# Altium schematic sheet Sheet1.SchDoc
size A4
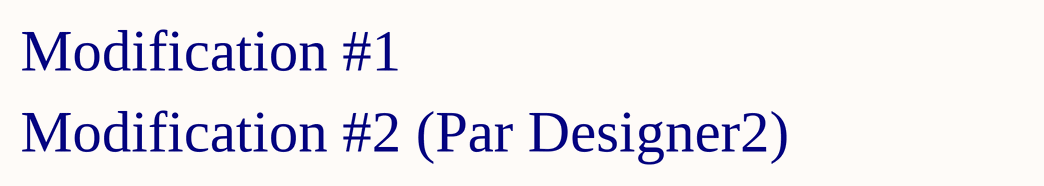
[diagram p0: Sheet1.SchDoc]

## Notes on the sheet
- Modification #1
- Modification #2 (Par Designer2)